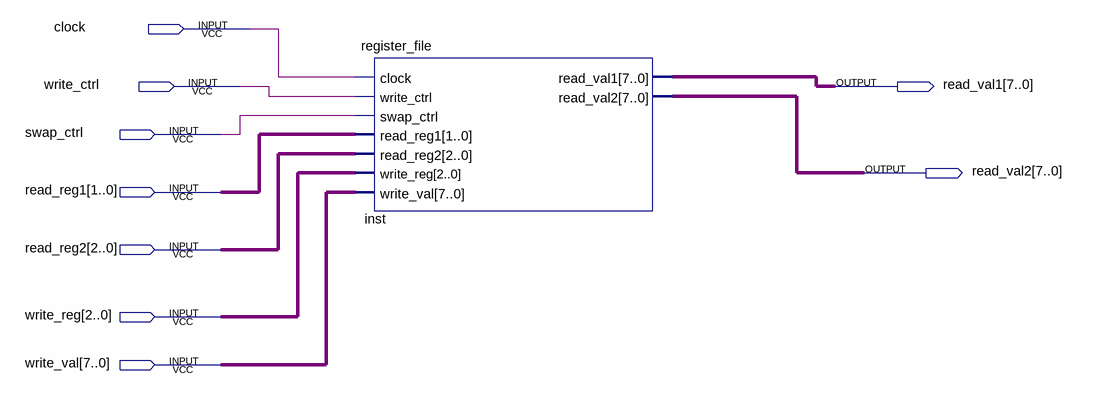
[diagram p0: schematic sheet]
// Quartus schematic regfilebench.bdf as structural Verilog: 1 symbols, 9 pins
module regfilebench (
  input  clock,
  input  write_ctrl,
  input  swap_ctrl,
  input  [1:0] read_reg1,
  input  [2:0] read_reg2,
  input  [2:0] write_reg,
  input  [7:0] write_val,
  output [7:0] read_val1,
  output [7:0] read_val2
);

  register_file inst (
    .clock(clock), .write_ctrl(write_ctrl), .swap_ctrl(swap_ctrl), .read_reg1(read_reg1),
    .read_reg2(read_reg2), .write_reg(write_reg), .write_val(write_val), .read_val1(read_val1),
    .read_val2(read_val2));
endmodule
